# EAGLE schematic Circuit Diagram (EAGLE 9.7.0)
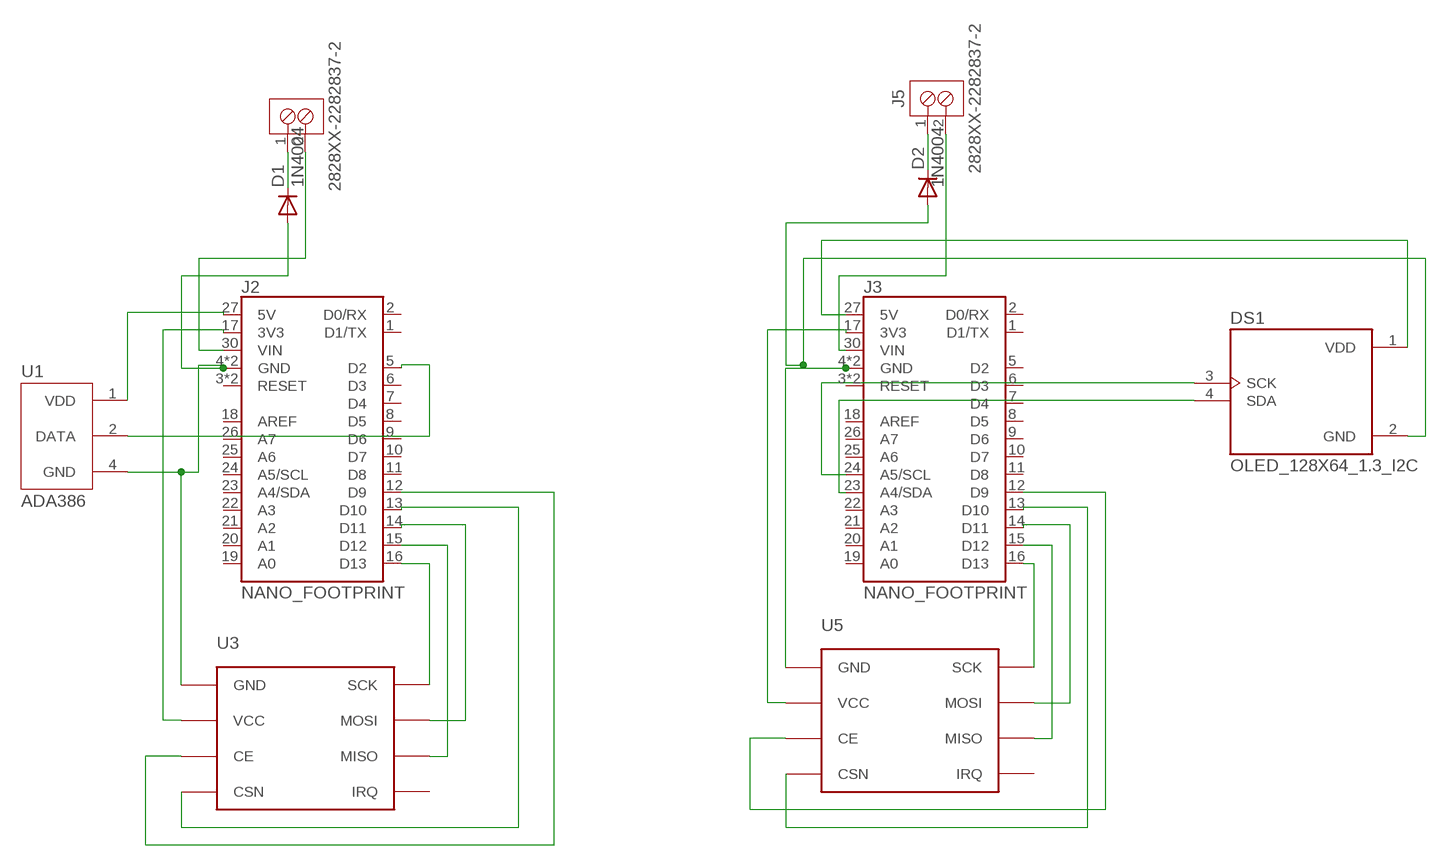
[diagram p0: schematic, sheet 1]

## Parts
D1  1N4004  [DO41-10]
D2  1N4004  [DO41-10]
DS1  OLED_128X64_1.3_I2C  [LCD_OLED_128X64_1.3_I2C]
J2  NANO_FOOTPRINT  [NANO]
J3  NANO_FOOTPRINT  [NANO]
J4  2828XX-2282837-2  [TERMBLK_508-2N]
J5  2828XX-2282837-2  [TERMBLK_508-2N]
U1  ADA386  [XDCR_ADA386]
U3  NRF24L01+-PCB-AERIAL  [NRF24L01-PCB-AERIAL]
U5  NRF24L01+-PCB-AERIAL  [NRF24L01-PCB-AERIAL]

## Nets
N$1: D1.A J2.4(GND) J2.29(GND) U1.4(GND) U3.P$1(GND)
N$2: J2.5(D2) U1.2(DATA)
N$3: J2.17(3V3) U3.P$2(VCC)
N$4: J2.12(D9) U3.P$3(CE)
N$5: J2.13(D10) U3.P$4(CSN)
N$6: J2.16(D13) U3.P$5(SCK)
N$7: J2.14(D11) U3.P$6(MOSI)
N$8: J2.15(D12) U3.P$7(MISO)
N$9: D2.A DS1.2(GND) J3.4(GND) J3.29(GND) U5.P$1(GND)
N$10: DS1.1(VDD) J3.27(5V)
N$11: J3.17(3V3) U5.P$2(VCC)
N$12: J3.12(D9) U5.P$3(CE)
N$13: J3.13(D10) U5.P$4(CSN)
N$14: J3.16(D13) U5.P$5(SCK)
N$15: J3.14(D11) U5.P$6(MOSI)
N$16: J3.15(D12) U5.P$7(MISO)
N$17: DS1.3(SCK) J3.24(A5/SCL)
N$18: DS1.4(SDA) J3.23(A4/SDA)
N$19: J2.27(5V) U1.1(VDD)
N$20: D1.C J4.1
N$21: J2.30(VIN) J4.2
N$22: D2.C J5.1
N$23: J3.30(VIN) J5.2
Unconnected: J2.1(D1/TX) J2.2(D0/RX) J2.3(RESET) J2.6(D3) J2.7(D4) J2.8(D5) J2.9(D6) J2.10(D7) J2.11(D8) J2.18(AREF) J2.19(A0) J2.20(A1) J2.21(A2) J2.22(A3) J2.23(A4/SDA) J2.24(A5/SCL) J2.25(A6) J2.26(A7) J2.28(RESET) J3.1(D1/TX) J3.2(D0/RX) J3.3(RESET) J3.5(D2) J3.6(D3) J3.7(D4) J3.8(D5) J3.9(D6) J3.10(D7) J3.11(D8) J3.18(AREF) J3.19(A0) J3.20(A1) J3.21(A2) J3.22(A3) J3.25(A6) J3.26(A7) J3.28(RESET) U3.P$8(IRQ) U5.P$8(IRQ)

## Library data of the parts
D1 D2 = adafruit:1N4004: DIODE General purpose 1N400x type rectifier (With bigger pads) http://www.ladyada.net/library/pcb/eaglelibrary.html
DS1 = OLED_128X64_1.3_I2C:OLED_128X64_1.3_I2C: Check availability <https://pricing.snapeda.com/parts/OLED%20128x64%201.3%26quot%3B%20I2C/UNIVERSAL-SOLDER%20Electronics%20Ltd/view-part?ref=eda>; AVAILABILITY: Not in stock; CHECK_PRICES: https://www.snapeda.com/parts/OLED%20128x64%201.3%22%20I2C/UNIVERSAL-SOLDER+Electronics+Ltd/view-part/?ref=eda; DESCRIPTION: Non-Touch Graphic LCD Display Module Transmissive White OLED, Monochrome I2C 1.3 (33.02mm) 128 x 64; MF: UNIVERSAL-SOLDER Electronics Ltd; MP: OLED 128x64 1.3&quot; I2C; PACKAGE: None; PRICE: None; SNAPEDA_LINK: https://www.snapeda.com/parts/OLED%20128x64%201.3%22%20I2C/UNIVERSAL-SOLDER+Electronics+Ltd/view-part/?ref=snap
J2 J3 = SparkFun-Boards:NANO_FOOTPRINT: Generic Nano Footprint
J4 J5 = Connector:2828XX-2: 2 Position Wire to Board Terminal Block Horizontal with Board Reference: Datasheet <https://www.te.com.cn/commerce/DocumentDelivery/DDEController?Action=showdoc&DocId=Catalog+Section%7F1308389_EUROSTYLE_TERMINAL_BLOCKS%7F0607%7Fpdf%7FEnglish%7FENG_CS_1308389_EUROSTYLE_TERMINAL_BLOCKS_0607.pdf%7F2-282837-5>; CATEGORY: Connectors; DATASHEET: https://www.te.com/usa-en/product-282837-2.datasheet.pdf; DESCRIPTION: 2 Position Wire to Board Terminal Block Horizontal with Board 0.200" (5.08mm) Through Hole; MANUFACTURER: TE Connectivity AMP Connectors; MPN: 282837-2; OPERATING_TEMPERATURE: -40°C ~ 105°C; PACKAGE_SIZE: NA; PACKAGE_TYPE: Through Hole; PART_STATUS: Active; PITCH: 0.200" (5.08mm); ROHS: Compliant; SERIES: Buchanan; SUBCATEGORY: Terminal Blocks; TYPE: Screw Terminal - Rising Cage Clamp Side Wire Entry
U1 = ADA386:ADA386: Check availability <https://pricing.snapeda.com/parts/ADA386/Adafruit%20Industries/view-part?ref=eda>; AVAILABILITY: Not in stock; CHECK_PRICES: https://www.snapeda.com/parts/ADA386/Adafruit+Industries/view-part/?ref=eda; DESCRIPTION: DHT11 basic temperature-humidity sensor + extras; MF: Adafruit Industries; MP: ADA386; PACKAGE: None; PRICE: None; SNAPEDA_LINK: https://www.snapeda.com/parts/ADA386/Adafruit+Industries/view-part/?ref=snap
U3 U5 = NRF24L01_:NRF24L01+: Check availability <https://pricing.snapeda.com/parts/NRF24L01%2B/Nordic%20Semiconductor/view-part?ref=eda>; AVAILABILITY: In Stock; CHECK_PRICES: https://www.snapeda.com/parts/NRF24L01+/Nordic+Power/view-part/?ref=eda; DESCRIPTION: IC RF TxRx Only General ISM > 1GHz 2.4GHz 20-VFQFN Exposed Pad; MF: Nordic Semiconductor; MP: NRF24L01+; PACKAGE: QFN-20 Nordic Semiconductor; PRICE: None; SNAPEDA_LINK: https://www.snapeda.com/parts/NRF24L01+/Nordic+Power/view-part/?ref=snap